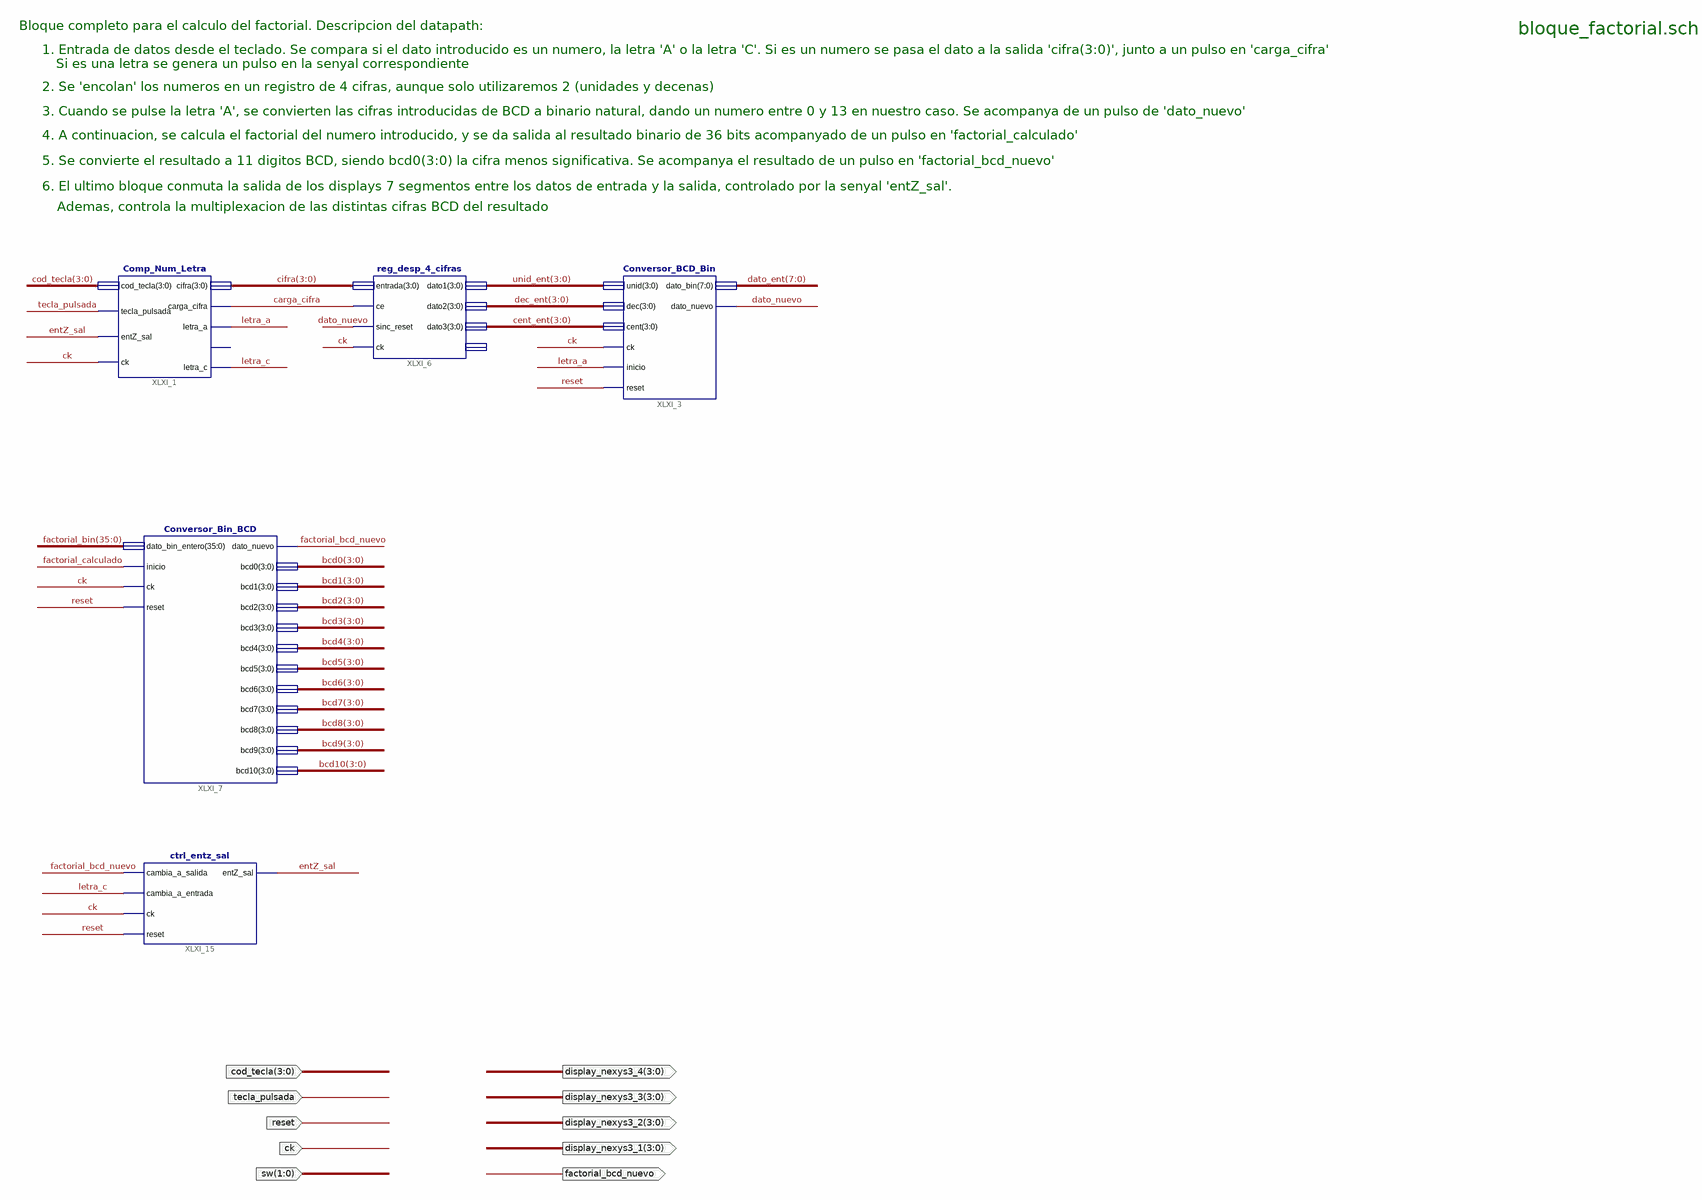
[diagram p0: schematic sheet 1]
// Xilinx ISE schematic bloque_factorial.sch (spartan6) as structural Verilog: 5 symbols, 10 ports
module bloque_factorial (
  input  [3:0] cod_tecla,
  input  ck,
  input  reset,
  input  tecla_pulsada,
  input  [1:0] sw,
  output [3:0] display_nexys3_4,
  output [3:0] display_nexys3_2,
  output [3:0] display_nexys3_3,
  output [3:0] display_nexys3_1,
  output factorial_bcd_nuevo
);

  wire carga_cifra, dato_nuevo, entZ_sal, factorial_calculado, letra_a, letra_c;
  wire [3:0] bcd0, bcd1, bcd2, bcd3, bcd4, bcd5, bcd6, bcd7, bcd8, bcd9, bcd10, cent_ent, cifra, dec_ent,
       unid_ent;
  wire [7:0] dato_ent;
  wire [35:0] factorial_bin;

  Comp_Num_Letra XLXI_1 (
    .tecla_pulsada(tecla_pulsada), .ck(ck), .cod_tecla(cod_tecla), .entZ_sal(entZ_sal),
    .carga_cifra(carga_cifra), .letra_a(letra_a), .cifra(cifra), .letra_c(letra_c));  // open: letra_b
  reg_desp_4_cifras XLXI_6 (
    .entrada(cifra), .dato1(unid_ent), .dato2(dec_ent), .dato3(cent_ent), .ck(ck), .sinc_reset(dato_nuevo),
    .ce(carga_cifra));  // open: dato4
  Conversor_BCD_Bin XLXI_3 (
    .unid(unid_ent), .dec(dec_ent), .cent(cent_ent), .ck(ck), .inicio(letra_a), .reset(reset),
    .dato_bin(dato_ent), .dato_nuevo(dato_nuevo));
  Conversor_Bin_BCD XLXI_7 (
    .dato_bin_entero(factorial_bin), .ck(ck), .inicio(factorial_calculado), .reset(reset),
    .dato_nuevo(factorial_bcd_nuevo), .bcd0(bcd0), .bcd1(bcd1), .bcd2(bcd2), .bcd3(bcd3), .bcd4(bcd4),
    .bcd5(bcd5), .bcd6(bcd6), .bcd7(bcd7), .bcd8(bcd8), .bcd9(bcd9), .bcd10(bcd10));
  ctrl_entz_sal XLXI_15 (
    .cambia_a_salida(factorial_bcd_nuevo), .cambia_a_entrada(letra_c), .ck(ck), .reset(reset),
    .entZ_sal(entZ_sal));

  // Notes on the sheet:
  //   Bloque completo para el calculo del factorial. Descripcion del datapath:
  //   bloque_factorial.sch
  //   1. Entrada de datos desde el teclado. Se compara si el dato introducido es un numero, la letra 'A' o la letra 'C'. Si es un numero se pasa el dato a la salida 'cifra(3:0)', junto a un pulso en 'carga_cifra'
  //   Si es una letra se genera un pulso en la senyal correspondiente
  //   2. Se 'encolan' los numeros en un registro de 4 cifras, aunque solo utilizaremos 2 (unidades y decenas)
  //   3. Cuando se pulse la letra 'A', se convierten las cifras introducidas de BCD a binario natural, dando un numero entre 0 y 13 en nuestro caso. Se acompanya de un pulso de 'dato_nuevo'
  //   4. A continuacion, se calcula el factorial del numero introducido, y se da salida al resultado binario de 36 bits acompanyado de un pulso en 'factorial_calculado'
  //   5. Se convierte el resultado a 11 digitos BCD, siendo bcd0(3:0) la cifra menos significativa. Se acompanya el resultado de un pulso en 'factorial_bcd_nuevo'
  //   6. El ultimo bloque conmuta la salida de los displays 7 segmentos entre los datos de entrada y la salida, controlado por la senyal 'entZ_sal'.
  //   Ademas, controla la multiplexacion de las distintas cifras BCD del resultado
endmodule
